# Altium schematic sheet 04_BANK_3_4.SchDoc
size OrCAD B
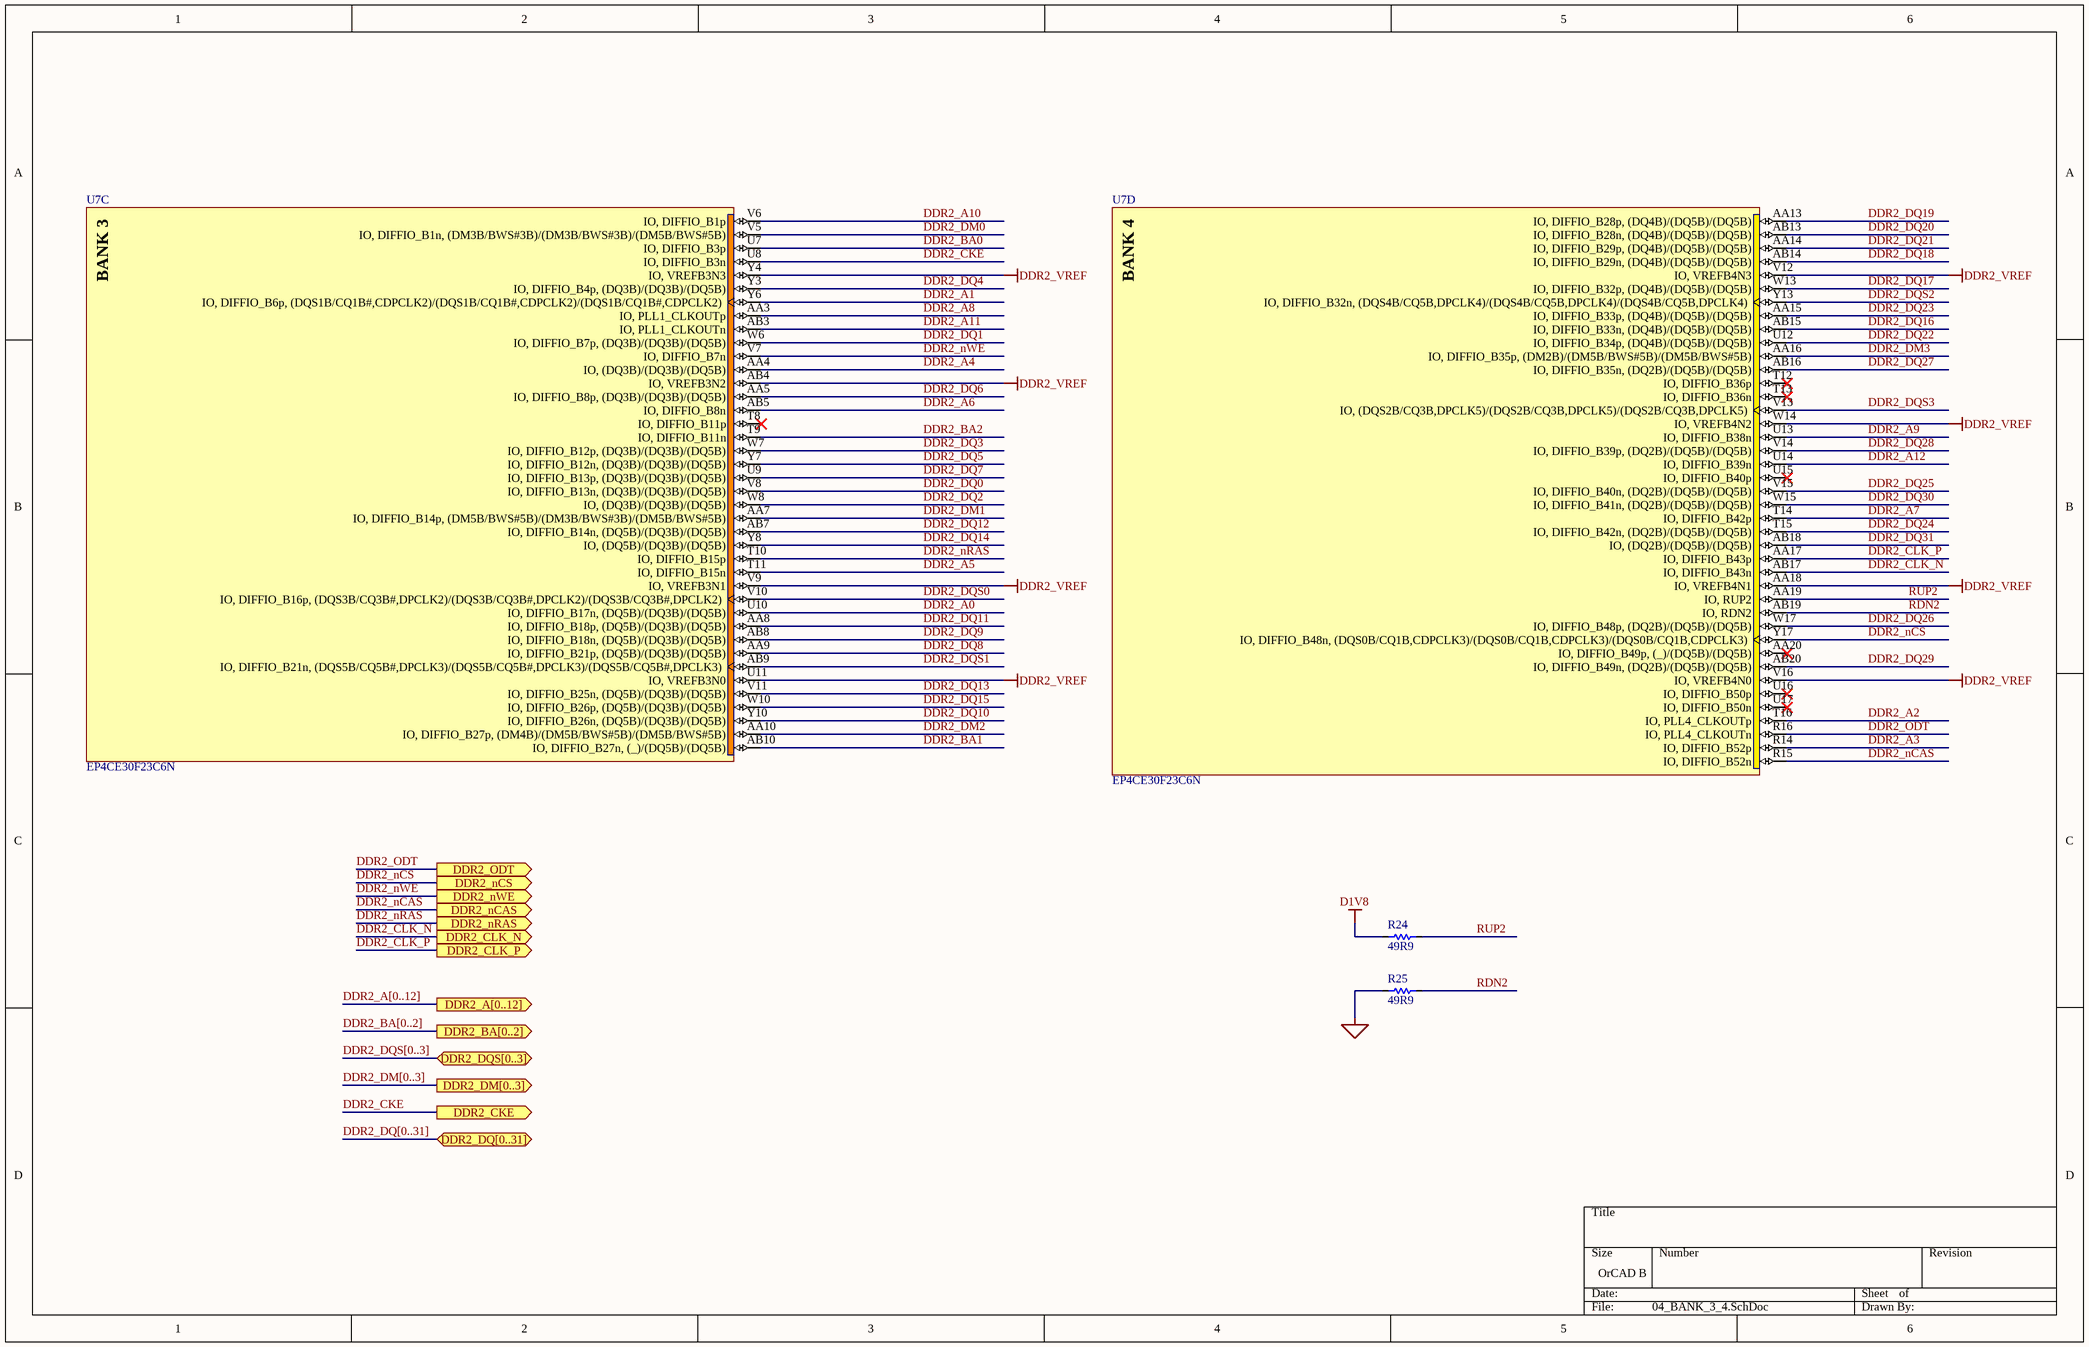
[diagram p0: 04_BANK_3_4.SchDoc]

## Parts
R24  49R9  [R0402]
R25  49R9  [R0402]
U7  EP4CE30F23C6N  [FBGA484_EP4CE30F23C6N]  (parts C,D of 13)

## Ports
DDR2_A[0..12] (out), DDR2_BA[0..2] (out), DDR2_CKE (out), DDR2_CLK_N (out), DDR2_CLK_P (out), DDR2_DM[0..3] (out), DDR2_DQ[0..31] (bidir), DDR2_DQS[0..3] (bidir), DDR2_nCAS (out), DDR2_nCS (out), DDR2_nRAS (out), DDR2_nWE (out), DDR2_ODT (out)

## Nets
D1V8: R24.1
DDR2_VREF: U7.AA18(IO,_VREFB4N1) U7.AB4(IO,_VREFB3N2) U7.U11(IO,_VREFB3N0) U7.V9(IO,_VREFB3N1) U7.V12(IO,_VREFB4N3) U7.V16(IO,_VREFB4N0) U7.W14(IO,_VREFB4N2) U7.Y4(IO,_VREFB3N3)
GND: R25.1
DDR2_A0: U7.U10(IO,_DIFFIO_B17n,_(DQ5B)/(DQ3B)/(DQ5B))
DDR2_A1: U7.Y6(IO,_DIFFIO_B6p,_(DQS1B/CQ1B#,CDPCLK2)/(DQS1B/CQ1B#,CDPCLK2)/(DQS1B/CQ1B#,CDPCLK2))
DDR2_A2: U7.T16(IO,_PLL4_CLKOUTp)
DDR2_A3: U7.R14(IO,_DIFFIO_B52p)
DDR2_A4: U7.AA4(IO,_(DQ3B)/(DQ3B)/(DQ5B))
DDR2_A5: U7.T11(IO,_DIFFIO_B15n)
DDR2_A6: U7.AB5(IO,_DIFFIO_B8n)
DDR2_A7: U7.T14(IO,_DIFFIO_B42p)
DDR2_A8: U7.AA3(IO,_PLL1_CLKOUTp)
DDR2_A9: U7.U13(IO,_DIFFIO_B38n)
DDR2_A10: U7.V6(IO,_DIFFIO_B1p)
DDR2_A11: U7.AB3(IO,_PLL1_CLKOUTn)
DDR2_A12: U7.U14(IO,_DIFFIO_B39n)
DDR2_BA0: U7.U7(IO,_DIFFIO_B3p)
DDR2_BA1: U7.AB10(IO,_DIFFIO_B27n,_(_)/(DQ5B)/(DQ5B))
DDR2_BA2: U7.T9(IO,_DIFFIO_B11n)
DDR2_CKE: U7.U8(IO,_DIFFIO_B3n) ; port DDR2_CKE
DDR2_CLK_N: U7.AB17(IO,_DIFFIO_B43n) ; port DDR2_CLK_N
DDR2_CLK_P: U7.AA17(IO,_DIFFIO_B43p) ; port DDR2_CLK_P
DDR2_DM0: U7.V5(IO,_DIFFIO_B1n,_(DM3B/BWS#3B)/(DM3B/BWS#3B)/(DM5B/BWS#5B))
DDR2_DM1: U7.AA7(IO,_DIFFIO_B14p,_(DM5B/BWS#5B)/(DM3B/BWS#3B)/(DM5B/BWS#5B))
DDR2_DM2: U7.AA10(IO,_DIFFIO_B27p,_(DM4B)/(DM5B/BWS#5B)/(DM5B/BWS#5B))
DDR2_DM3: U7.AA16(IO,_DIFFIO_B35p,_(DM2B)/(DM5B/BWS#5B)/(DM5B/BWS#5B))
DDR2_DQ0: U7.V8(IO,_DIFFIO_B13n,_(DQ3B)/(DQ3B)/(DQ5B))
DDR2_DQ1: U7.W6(IO,_DIFFIO_B7p,_(DQ3B)/(DQ3B)/(DQ5B))
DDR2_DQ2: U7.W8(IO,_(DQ3B)/(DQ3B)/(DQ5B))
DDR2_DQ3: U7.W7(IO,_DIFFIO_B12p,_(DQ3B)/(DQ3B)/(DQ5B))
DDR2_DQ4: U7.Y3(IO,_DIFFIO_B4p,_(DQ3B)/(DQ3B)/(DQ5B))
DDR2_DQ5: U7.Y7(IO,_DIFFIO_B12n,_(DQ3B)/(DQ3B)/(DQ5B))
DDR2_DQ6: U7.AA5(IO,_DIFFIO_B8p,_(DQ3B)/(DQ3B)/(DQ5B))
DDR2_DQ7: U7.U9(IO,_DIFFIO_B13p,_(DQ3B)/(DQ3B)/(DQ5B))
DDR2_DQ8: U7.AA9(IO,_DIFFIO_B21p,_(DQ5B)/(DQ3B)/(DQ5B))
DDR2_DQ9: U7.AB8(IO,_DIFFIO_B18n,_(DQ5B)/(DQ3B)/(DQ5B))
DDR2_DQ10: U7.Y10(IO,_DIFFIO_B26n,_(DQ5B)/(DQ3B)/(DQ5B))
DDR2_DQ11: U7.AA8(IO,_DIFFIO_B18p,_(DQ5B)/(DQ3B)/(DQ5B))
DDR2_DQ12: U7.AB7(IO,_DIFFIO_B14n,_(DQ5B)/(DQ3B)/(DQ5B))
DDR2_DQ13: U7.V11(IO,_DIFFIO_B25n,_(DQ5B)/(DQ3B)/(DQ5B))
DDR2_DQ14: U7.Y8(IO,_(DQ5B)/(DQ3B)/(DQ5B))
DDR2_DQ15: U7.W10(IO,_DIFFIO_B26p,_(DQ5B)/(DQ3B)/(DQ5B))
DDR2_DQ16: U7.AB15(IO,_DIFFIO_B33n,_(DQ4B)/(DQ5B)/(DQ5B))
DDR2_DQ17: U7.W13(IO,_DIFFIO_B32p,_(DQ4B)/(DQ5B)/(DQ5B))
DDR2_DQ18: U7.AB14(IO,_DIFFIO_B29n,_(DQ4B)/(DQ5B)/(DQ5B))
DDR2_DQ19: U7.AA13(IO,_DIFFIO_B28p,_(DQ4B)/(DQ5B)/(DQ5B))
DDR2_DQ20: U7.AB13(IO,_DIFFIO_B28n,_(DQ4B)/(DQ5B)/(DQ5B))
DDR2_DQ21: U7.AA14(IO,_DIFFIO_B29p,_(DQ4B)/(DQ5B)/(DQ5B))
DDR2_DQ22: U7.U12(IO,_DIFFIO_B34p,_(DQ4B)/(DQ5B)/(DQ5B))
DDR2_DQ23: U7.AA15(IO,_DIFFIO_B33p,_(DQ4B)/(DQ5B)/(DQ5B))
DDR2_DQ24: U7.T15(IO,_DIFFIO_B42n,_(DQ2B)/(DQ5B)/(DQ5B))
DDR2_DQ25: U7.V15(IO,_DIFFIO_B40n,_(DQ2B)/(DQ5B)/(DQ5B))
DDR2_DQ26: U7.W17(IO,_DIFFIO_B48p,_(DQ2B)/(DQ5B)/(DQ5B))
DDR2_DQ27: U7.AB16(IO,_DIFFIO_B35n,_(DQ2B)/(DQ5B)/(DQ5B))
DDR2_DQ28: U7.V14(IO,_DIFFIO_B39p,_(DQ2B)/(DQ5B)/(DQ5B))
DDR2_DQ29: U7.AB20(IO,_DIFFIO_B49n,_(DQ2B)/(DQ5B)/(DQ5B))
DDR2_DQ30: U7.W15(IO,_DIFFIO_B41n,_(DQ2B)/(DQ5B)/(DQ5B))
DDR2_DQ31: U7.AB18(IO,_(DQ2B)/(DQ5B)/(DQ5B))
DDR2_DQS0: U7.V10(IO,_DIFFIO_B16p,_(DQS3B/CQ3B#,DPCLK2)/(DQS3B/CQ3B#,DPCLK2)/(DQS3B/CQ3B#,DPCLK2))
DDR2_DQS1: U7.AB9(IO,_DIFFIO_B21n,_(DQS5B/CQ5B#,DPCLK3)/(DQS5B/CQ5B#,DPCLK3)/(DQS5B/CQ5B#,DPCLK3))
DDR2_DQS2: U7.Y13(IO,_DIFFIO_B32n,_(DQS4B/CQ5B,DPCLK4)/(DQS4B/CQ5B,DPCLK4)/(DQS4B/CQ5B,DPCLK4))
DDR2_DQS3: U7.V13(IO,_(DQS2B/CQ3B,DPCLK5)/(DQS2B/CQ3B,DPCLK5)/(DQS2B/CQ3B,DPCLK5))
DDR2_nCAS: U7.R15(IO,_DIFFIO_B52n) ; port DDR2_nCAS
DDR2_nCS: U7.Y17(IO,_DIFFIO_B48n,_(DQS0B/CQ1B,CDPCLK3)/(DQS0B/CQ1B,CDPCLK3)/(DQS0B/CQ1B,CDPCLK3)) ; port DDR2_nCS
DDR2_nRAS: U7.T10(IO,_DIFFIO_B15p) ; port DDR2_nRAS
DDR2_nWE: U7.V7(IO,_DIFFIO_B7n) ; port DDR2_nWE
DDR2_ODT: U7.R16(IO,_PLL4_CLKOUTn) ; port DDR2_ODT
RDN2: R25.2 U7.AB19(IO,_RDN2)
RUP2: R24.2 U7.AA19(IO,_RUP2)

Not connected (* = marked no-connect by the designer): U7 AA20(IO,_DIFFIO_B49p,_(_)/(DQ5B)/(DQ5B))* T8(IO,_DIFFIO_B11p)* T12(IO,_DIFFIO_B36p)* T13(IO,_DIFFIO_B36n)* U15(IO,_DIFFIO_B40p)* U16(IO,_DIFFIO_B50p)* U17(IO,_DIFFIO_B50n)*

## Buses and harness runs
bus DDR2_A[0..12] = port DDR2_A[0..12]
bus DDR2_BA[0..2] = port DDR2_BA[0..2]
bus DDR2_DM[0..3] = port DDR2_DM[0..3]
bus DDR2_DQ[0..31] = port DDR2_DQ[0..31]
bus DDR2_DQS[0..3] = port DDR2_DQS[0..3]

## Notes on the sheet
- (in symbol EP4CE30F23C6N, part C) BANK 3
- (in symbol EP4CE30F23C6N, part D) BANK 4

## Library data of the parts
R24 R25 = RES0127_1: RES,49R9,1%,1/16W,0402; Manufacturer1: *; PartNumberManufacturer2: *; Manufacturer2: *; PartNumberManufacturer1: *; Value: 49R9; UnitPrice: *
U7 = EP4CE30F23C6N: IC,FPGA,28848 LEs,Speed-6,FBGA484; Manufacturer1: ALTERA; PartNumberManufacturer1: EP4CE30F23C6N; UnitPrice: *; PartNumberManufacturer2: *; Manufacturer2: *